# Altium schematic sheet Sheet2.SchDoc
size A
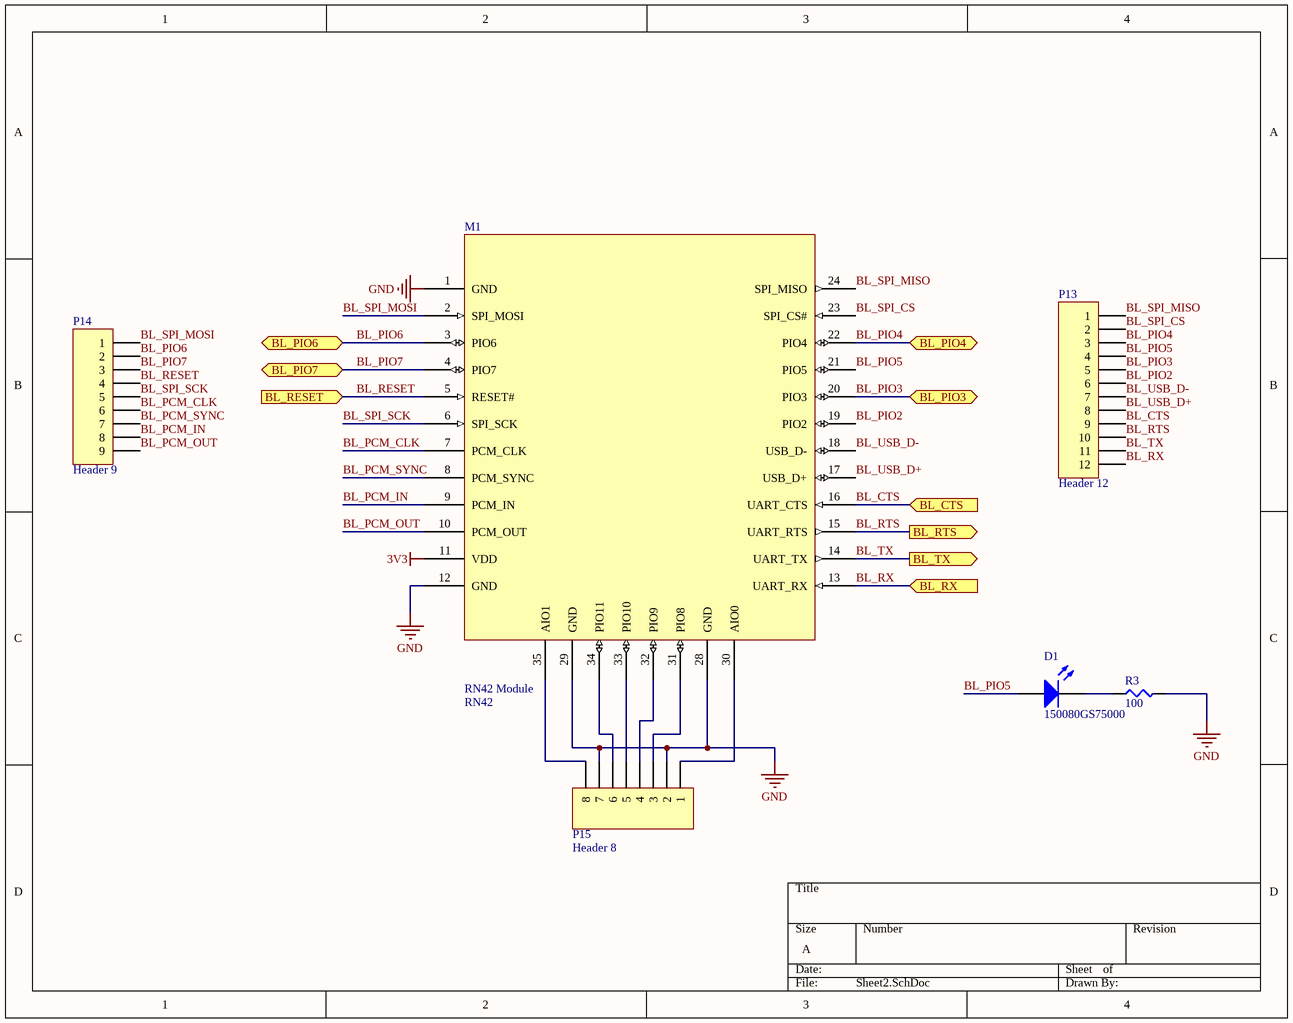
[diagram p0: Sheet2.SchDoc]

## Parts
D1  150080GS75000  [0805_A]
M1  RN42 Module  value RN42  [RN42-LAND]  (no BOM)
P13  Header 12  [HDR1X12]
P14  Header 9  [HDR1X9]
P15  Header 8  [HDR1X8]
R3  100  [SMD-0805-RES]

## Ports
BL_CTS (in), BL_PIO3 (bidir), BL_PIO4 (bidir), BL_PIO6 (bidir), BL_PIO7 (bidir), BL_RESET (in), BL_RTS (out), BL_RX (in), BL_TX (out)

## Nets
3V3: M1.11(VDD)
GND: M1.1(GND) M1.12(GND) M1.28(GND) M1.29(GND) P15.2 P15.7 R3.2
BL_CTS: M1.16(UART_CTS) P13.9 ; port BL_CTS
BL_PCM_CLK: M1.7(PCM_CLK) P14.6
BL_PCM_IN: M1.9(PCM_IN) P14.8
BL_PCM_OUT: M1.10(PCM_OUT) P14.9
BL_PCM_SYNC: M1.8(PCM_SYNC) P14.7
BL_PIO2: M1.19(PIO2) P13.6
BL_PIO3: M1.20(PIO3) P13.5 ; port BL_PIO3
BL_PIO4: M1.22(PIO4) P13.3 ; port BL_PIO4
BL_PIO5: D1.2(A) M1.21(PIO5) P13.4
BL_PIO6: M1.3(PIO6) P14.2 ; port BL_PIO6
BL_PIO7: M1.4(PIO7) P14.3 ; port BL_PIO7
BL_RESET: M1.5(RESET#) P14.4 ; port BL_RESET
BL_RTS: M1.15(UART_RTS) P13.10 ; port BL_RTS
BL_RX: M1.13(UART_RX) P13.12 ; port BL_RX
BL_SPI_CS: M1.23(SPI_CS#) P13.2
BL_SPI_MISO: M1.24(SPI_MISO) P13.1
BL_SPI_MOSI: M1.2(SPI_MOSI) P14.1
BL_SPI_SCK: M1.6(SPI_SCK) P14.5
BL_TX: M1.14(UART_TX) P13.11 ; port BL_TX
BL_USB_D+: M1.17(USB_D+) P13.8
BL_USB_D-: M1.18(USB_D-) P13.7
NetD1_1: D1.1(K) R3.1
NetM1_30: M1.30(AIO0) P15.1
NetM1_31: M1.31(PIO8) P15.3
NetM1_32: M1.32(PIO9) P15.4
NetM1_33: M1.33(PIO10) P15.5
NetM1_34: M1.34(PIO11) P15.6
NetM1_35: M1.35(AIO1) P15.8

## Library data of the parts
D1 = 150080GS75000: SMD mono-color Chip LED, WL-SMCW, Green; PackageReference: 0805_A; Color: Green; PartNumber: 150080GS75000; ComponentLink1Description: Manufacturer URL; ComponentLink1URL: http://www.we-online.com; ComponentLink2Description: Datasheet; ComponentLink2URL: http://katalog.we-online.com/led/datasheet/150080GS75000.pdf
M1 = RN42MOD
P13 = Header 12: Header, 12-Pin; LatestRevisionDate: 17-Jul-2002; LatestRevisionNote: Re-released for DXP Platform.; Publisher: Altium Limited
P14 = Header 9: Header, 9-Pin; LatestRevisionDate: 17-Jul-2002; LatestRevisionNote: Re-released for DXP Platform.; Publisher: Altium Limited
P15 = Header 8: Header, 8-Pin; LatestRevisionDate: 17-Jul-2002; LatestRevisionNote: Re-released for DXP Platform.; Publisher: Altium Limited
R3 = ERJ-6ENF1000V: RES SMD 100 OHM 1% 1/8W 0805; Manufacturer: Panasonic Electronic Components; Factory Stock: 0; Unit Price (USD): 0.00729; @ qty: 1500; Minimum Quantity: 1; Power (Watts): 0.125W, 1/8W; Temperature Coefficient: ±100ppm/°C; Value: 100; Part Number: ERJ-6ENF1000V; Datasheets: http://industrial.panasonic.com/www-cgi/jvcr13pz.cgi?E+PZ+3+AOA0002+ERJ6ENF1000V+7+WW; Image: //media.digikey.com/Renders/Panasonic%20Renders/ERJ-0805%20Pkg.jpg; Digi-Key Part Number: P100CCT-ND; Quantity Available: 288663; Packaging: Cut Tape (CT); Series: ERJ; Part Status: Active; Tolerance: ±1%; Composition: Thick Film; Features: Automotive AEC-Q200; Operating Temperature: -55°C ~ 155°C; Package / Case: 0805 (2012 Metric); Supplier Device Package: 0805; Size / Dimension: 0.079" L x 0.049" W (2.00mm x 1.25mm); Height - Seated (Max): 0.028" (0.70mm); Number of Terminations: 2; Failure Rate: -